# Altium schematic sheet Power.SchDoc
size A3; SheetNumber: 4; SheetTotal: 8
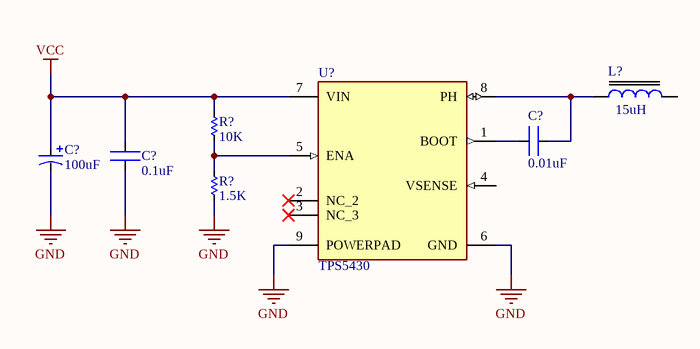
[diagram p0: Power.SchDoc]

## Parts
(Parts that share a designator on the sheet are numbered #1, #2 ... from top to bottom, then left to right.)
C?#1  0.01uF  [CAP - 0805]
C?#2  100uF  [Alu_Cap_6.3_7.7]
C?#3  0.1uF  [CAP - 0805]
L?  15uH  [L_SMD_12x12mm]
R?#1  10K  [RES - 0805]
R?#2  1.5K  [RES - 0805]
U?  TPS5430  [TPS5430]

## Nets
GND: C?#2.2 C?#3.2 R?#2.2 U?.6(GND) U?.9(POWERPAD)
VCC: C?#2.1 C?#3.1 R?#1.1 U?.7(VIN)
NetC?#1_1: C?#1.1 U?.1(BOOT)
NetC?#1_2: C?#1.2 L?.1 U?.8(PH)
NetR?#1_2: R?#1.2 R?#2.1 U?.5(ENA)

Not connected (* = marked no-connect by the designer): L? 2(5); U? 2(NC_2)* 3(NC_3)* 4(VSENSE)

## Library data of the parts
C?#1 C?#3 = CAPACITOR: CAPACITOR SMD - KEMET
C?#2 = Alu_Capacitor
L? = Inductor_1_SMD
R?#1 R?#2 = RESISTOR: Resistor SMD - YAGEO
U? = TPS5430: Buck DC to DC Converter